# EAGLE design dwm-breakout (EAGLE 9.5.1)
AUTHOR: Neal Jackson; REV: A; TITLE: DWM1001C BREAKOUT
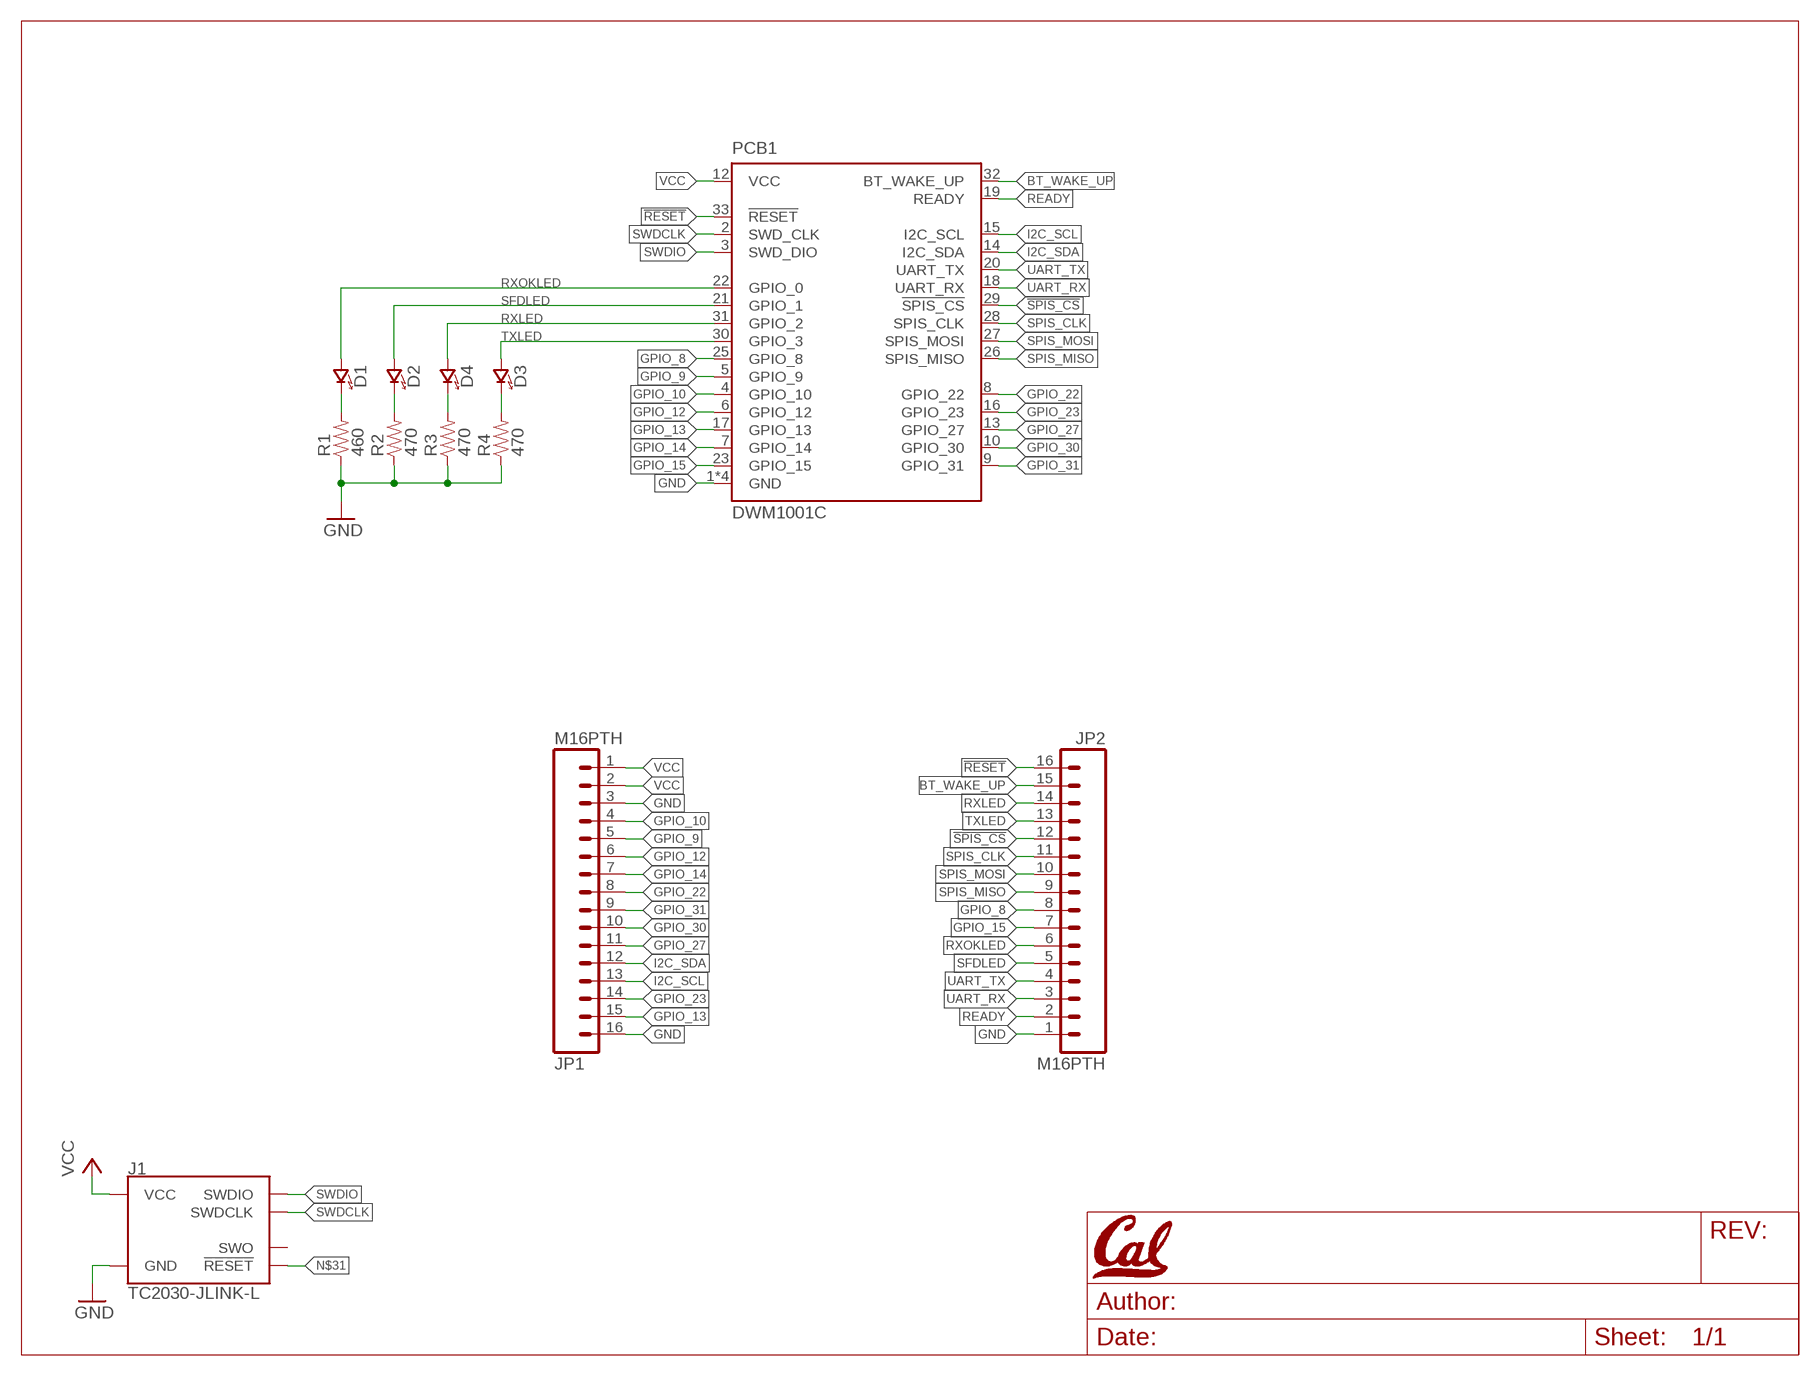
[diagram p0: schematic, sheet 1]
U$1 (LETTER_L_CAL): HEIGHT: 8.5in; WIDTH: 11in

## Parts
D1  LED0603  [LED-0603]
D2  LED0603  [LED-0603]
D3  LED0603  [LED-0603]
D4  LED0603  [LED-0603]
J1  TC2030-JLINK-L  [TC2030-IDC]
JP1  M16PTH  [1X16]
JP2  M16PTH  [1X16]
PCB1  DWM1001C  [DWM1001C]
R1  460  RESISTOR0402_RES  [0402_RES]
R2  470  RESISTOR0402_RES  [0402_RES]
R3  470  RESISTOR0402_RES  [0402_RES]
R4  470  RESISTOR0402_RES  [0402_RES]

## Nets
!RESET: JP2.16 PCB1.33(!RESET)
!SPIS_CS: JP2.12 PCB1.29(!SPIS_CS)
BT_WAKE_UP: JP2.15 PCB1.32(BT_WAKE_UP)
GND: J1.5(GND) JP1.3 JP1.16 JP2.1 PCB1.1(GND) PCB1.11(GND) PCB1.24(GND) PCB1.34(GND) R1.1 R2.1 R3.1 R4.1
GPIO_8: JP2.8 PCB1.25(GPIO_8)
GPIO_9: JP1.5 PCB1.5(GPIO_9)
GPIO_10: JP1.4 PCB1.4(GPIO_10)
GPIO_12: JP1.6 PCB1.6(GPIO_12)
GPIO_13: JP1.15 PCB1.17(GPIO_13)
GPIO_14: JP1.7 PCB1.7(GPIO_14)
GPIO_15: JP2.7 PCB1.23(GPIO_15)
GPIO_22: JP1.8 PCB1.8(GPIO_22)
GPIO_23: JP1.14 PCB1.16(GPIO_23)
GPIO_27: JP1.11 PCB1.13(GPIO_27)
GPIO_30: JP1.10 PCB1.10(GPIO_30)
GPIO_31: JP1.9 PCB1.9(GPIO_31)
I2C_SCL: JP1.13 PCB1.15(I2C_SCL)
I2C_SDA: JP1.12 PCB1.14(I2C_SDA)
N$1: D1.C(CATHODE) R1.2
N$6: D2.C(CATHODE) R2.2
N$7: D4.C(CATHODE) R3.2
N$8: D3.C(CATHODE) R4.2
N$31: J1.3(!RESET)
READY: JP2.2 PCB1.19(READY)
RXLED: D4.A(ANODE) JP2.14 PCB1.31(GPIO_2)
RXOKLED: D1.A(ANODE) JP2.6 PCB1.22(GPIO_0)
SFDLED: D2.A(ANODE) JP2.5 PCB1.21(GPIO_1)
SPIS_CLK: JP2.11 PCB1.28(SPIS_CLK)
SPIS_MISO: JP2.9 PCB1.26(SPIS_MISO)
SPIS_MOSI: JP2.10 PCB1.27(SPIS_MOSI)
SWDCLK: J1.4(SWDCLK) PCB1.2(SWD_CLK)
SWDIO: J1.2(SWDIO) PCB1.3(SWD_DIO)
TXLED: D3.A(ANODE) JP2.13 PCB1.30(GPIO_3)
UART_RX: JP2.3 PCB1.18(UART_RX)
UART_TX: JP2.4 PCB1.20(UART_TX)
VCC: J1.1(VCC) JP1.1 JP1.2 PCB1.12(VCC)
Unconnected: J1.6(SWO)

## Library data of the parts
D1 = leds:LED: LED; DIGIKEY: 160-1835-6-ND; MPN: LTST-C104KRKT
D2 = leds:LED: LED; DIGIKEY: 160-1837-6-ND; MPN: LTST-C194TBKT
D3 = leds:LED: LED; DIGIKEY: 160-1184-6-ND; MPN: LTST-C190YKT
D4 = leds:LED: LED; DIGIKEY: 160-1834-6-ND; MPN: LTST-C194KGKT
J1 = connector:TC2030-JLINK
JP1 JP2 = SparkFun-Connectors:M16: 1x16 .1" header
PCB1 = chips:DWM1001C: The DWM1001 module is based on Decawave's DW1000 Ultra Wideband (UWB) transceiver IC, which is an IEEE 802.15.4- 2011 UWB implementation. It integrates UWB and Bluetooth® antenna, all RF circuitry, Nordic Semiconductor nRF52832 and a motion sensor.; DIGIKEY: 1479-1004-1-ND; MPN: DWM1001C
R1-R4 = passives:RESISTOR: Resistor Basic schematic elements and footprints for 0201, 0402, 0603, 1206, and PTH resistors.; DIGIKEY: RHM470JCT-ND; MPN: MCR01MZPJ471

## Board
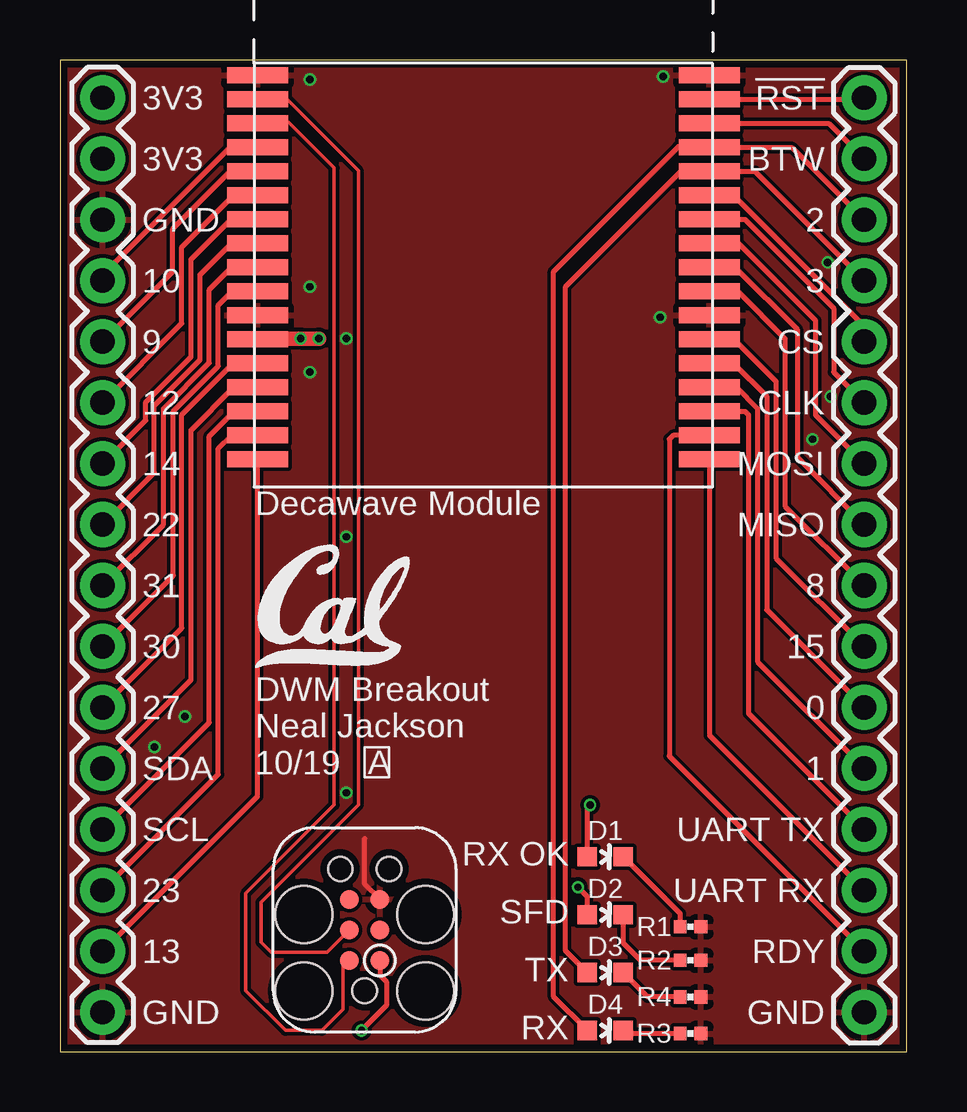
[diagram p1: board, top side]
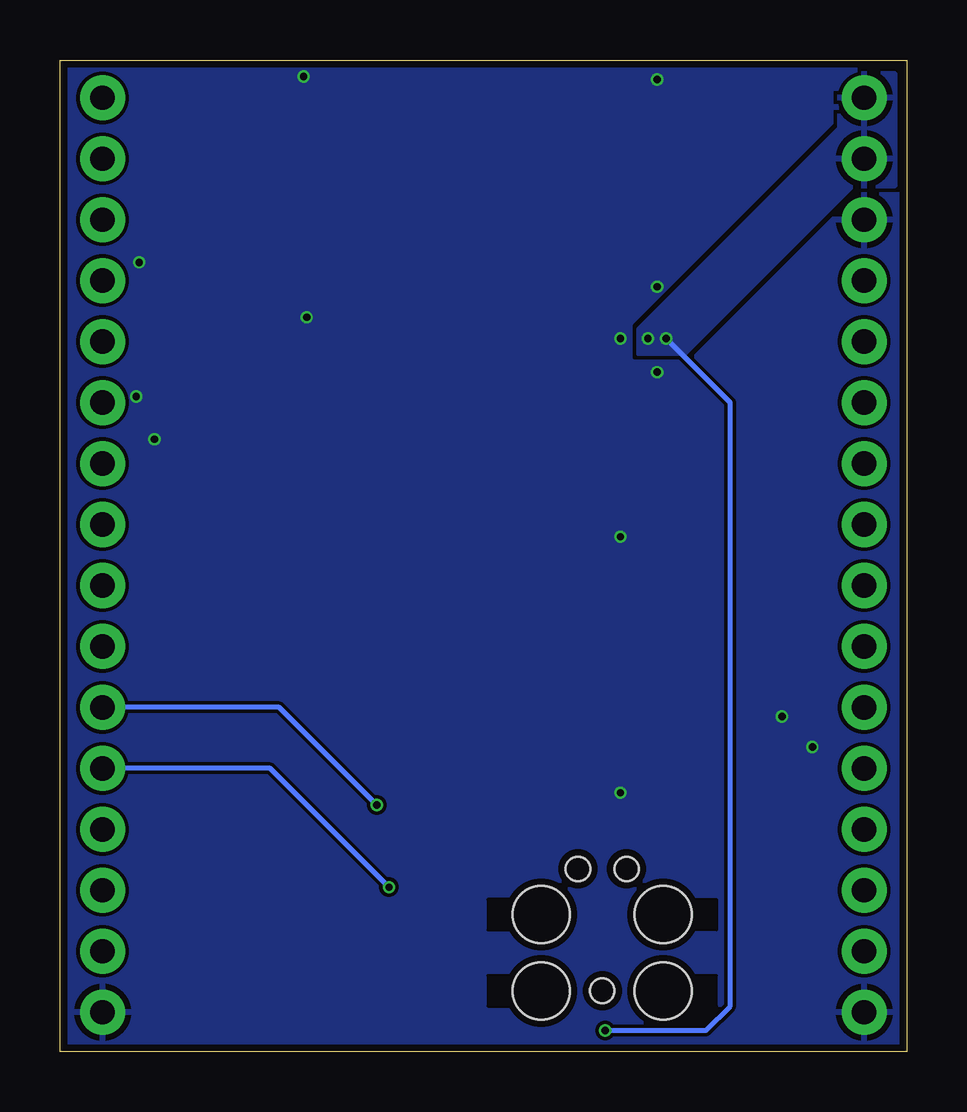
[diagram p2: board, bottom side, seen from below]

Size 35.31 x 41.33 mm. Coordinates in mm from the lower left corner, seen from the top.
Outline: 0,0 35.31,0 35.31,41.33 0,41.33 0,0
Copper layers (1*16): Top 0.0178mm / dielectric 59mil / Bottom 0.0178mm
Design rules "quickturn_co_kr_1oz": minimum track width 4mil, minimum drill 0.200659375mm, track to track 6mil, track to pad 6mil, pad to pad 6mil, via to via 6mil, smd to smd 6mil, copper to edge 12mil, drill to drill 12mil, minimum pad ring 8mil, minimum via ring 4mil, stop-mask expansion 3mil, vias tented up to drill 50mil, thermal gap 10mil

### Footprints (pad centres in the part's own frame; a part is rotated, then mirrored left to right if it is on the bottom)
LED-0603 = smd 0.8 x 0.8: A 0,-0.75; C 0,0.75
TC2030-IDC = smd 0.787 x 0.787: 1 -1.27,-0.635; 2 -1.27,0.635; 3 0,-0.635; 4 0,0.635; 5 1.27,-0.635; 6 1.27,0.635 | hole 2.375: -2.54,2.54; 0.635,2.54; 0.635,-2.54; -2.54,-2.54 | hole 1.016: -2.54,0; 2.54,1.016; 2.54,-1.016
1X16 = drill 1.016 pad 1.88: 1 0,0; 2 2.54,0; 3 5.08,0; 4 7.62,0; 5 10.16,0; 6 12.7,0; 7 15.24,0; 8 17.78,0; 9 20.32,0; 10 22.86,0; 11 25.4,0; 12 27.94,0; 13 30.48,0; 14 33.02,0; 15 35.56,0; 16 38.1,0
DWM1001C = smd 2.54 x 0.65: 1 -9.42,8; 2 -9.42,7; 3 -9.42,6; 4 -9.42,5; 5 -9.42,4; 6 -9.42,3; 7 -9.42,2; 8 -9.42,1; 9 -9.42,0; 10 -9.42,-1; 11 -9.42,-2; 12 -9.42,-3; 13 -9.42,-4; 14 -9.42,-5; 15 -9.42,-6; 16 -9.42,-7; 17 -9.42,-8; 18 9.42,-8; 19 9.42,-7; 20 9.42,-6; 21 9.42,-5; 22 9.42,-4; 23 9.42,-3; 24 9.42,-2; 25 9.42,-1; 26 9.42,0; 27 9.42,1; 28 9.42,2; 29 9.42,3; 30 9.42,4; 31 9.42,5; 32 9.42,6; 33 9.42,7; 34 9.42,8
0402_RES = smd 0.536 x 0.546: 1 -0.433,0; 2 0.433,0

### Placement (x,y rotation side)
D1  22.73,8.13 270 top
D2  22.73,5.71 270 top
D3  22.73,3.3 270 top
D4  22.73,0.89 270 top
J1  12.7,5.08 90 top
JP1  1.78,39.75 270 top
JP2  33.53,1.65 90 top
PCB1  17.65,32.69 0 top
R1  26.29,5.21 180 top
R2  26.29,3.81 180 top
R3  26.29,0.76 180 top
R4  26.29,2.29 180 top
U$2  [UCB_CAL_200MIL]  8.13,16 0 top

### Tracks (layer width: path | path; a pad name or v marks a point on that pad's centre or on a via)
!RESET
  Top 0.203: PCB1.33 33.47,39.69 JP2.16
!SPIS_CS
  Top 0.203: PCB1.29 28.06,35.69 33.53,30.23 JP2.12
BT_WAKE_UP
  Top 0.203: PCB1.32 32.05,38.69 JP2.15
GND  (via drill 0.3)
  Top 0.203: J1.5 12.7,6.99 12.7,8.89
  other vias: 32,32.89 32.13,27.3 31.37,25.53 3.94,12.7 5.21,13.97 11.94,10.79 11.94,21.46 11.94,29.72 10.41,28.32 10.41,31.88 10.41,40.51 25.02,30.61 25.15,40.64
  pour Top: 0,41.15 35.31,41.15 35.31,0 0,0
  pour Bottom (rank 2): 0,41.15 35.31,41.15 35.31,0 0,0
GPIO_8
  Top 0.203: PCB1.25 28.25,31.69 30.23,29.72 30.23,22.73 JP2.8
GPIO_9
  Top 0.203: JP1.5 4.7,32.51 4.7,34.29 7.11,36.7 8.22,36.7 PCB1.5
GPIO_10
  Top 0.203: PCB1.4 7.14,37.69 7.11,37.72 1.78,32.38 JP1.4
GPIO_12
  Top 0.203: PCB1.6 7.24,35.69 5.08,33.53 5.08,30.35 JP1.6
GPIO_13
  Top 0.203: JP1.15 8.23,10.65 PCB1.17
GPIO_14
  Top 0.203: PCB1.7 7.13,34.69 5.46,33.02 5.46,28.95 3.58,27.07 3.58,26.31 JP1.7
GPIO_15
  Top 0.203: PCB1.23 28.09,29.69 29.84,27.94 29.84,20.57 JP2.7
GPIO_22
  Top 0.203: JP1.8 3.94,24.13 3.94,26.92 5.84,28.83 5.84,32.38 7.15,33.69 PCB1.8
GPIO_23
  Top 0.203: PCB1.16 7.15,25.69 6.6,25.15 6.6,11.56 JP1.14
GPIO_27
  Top 0.203: JP1.11 5.08,17.65 5.08,26.54 7.24,28.7 8.22,28.7 PCB1.13
GPIO_30
  Top 0.203: PCB1.10 7.18,31.69 6.6,31.11 6.6,28.57 4.72,26.69 4.72,19.84 JP1.10
GPIO_31
  Top 0.203: JP1.9 4.32,21.97 4.32,26.8 6.22,28.7 6.22,31.75 7.16,32.69 PCB1.9
I2C_SCL
  Top 0.203: JP1.13 6.22,13.72 6.22,25.65 7.26,26.69 PCB1.15
I2C_SDA
  Top 0.203: JP1.12 5.46,15.49 5.46,25.91 7.24,27.69 PCB1.14
N$1
  Top 0.203: R1.2 25.86,5.75 D1.C
N$6
  Top 0.203: R2.2 24.2,3.81 23.48,4.53 D2.C
N$7
  Top 0.203: D4.C 23.61,0.76 R3.2
N$8
  Top 0.203: R4.2 24.5,2.29 D3.C
READY
  Top 0.203: PCB1.19 25.56,25.69 25.4,25.53 25.4,12.32 JP2.2
RXLED
  Top 0.203: JP2.14 30.51,37.69 PCB1.31 27.04,37.72 25.78,37.72 20.57,32.51 20.57,2.3 D4.A
RXOKLED  (via drill 0.3)
  Top 0.203: PCB1.22 28.08,28.69 29.46,27.3 29.46,18.41 JP2.6 | D1.A 21.98,10.17 v22.1,10.29
  Bottom 0.203: v22.1,10.29 26.16,14.35 JP2.6
SFDLED  (via drill 0.3)
  Top 0.203: PCB1.21 28.19,27.69 29.08,26.8 29.08,16.26 JP2.5 | D2.A 21.98,6.46 v21.59,6.86
  Bottom 0.203: v21.59,6.86 26.54,11.81 JP2.5
SPIS_CLK
  Top 0.203: 28.05,34.69 PCB1.28 28.56,34.69 32.26,30.99 32.26,28.32 JP2.11
SPIS_MISO
  Top 0.203: PCB1.26 28.14,32.69 30.73,30.1 30.73,24.77 JP2.9
SPIS_MOSI
  Top 0.203: PCB1.27 28.29,33.69 31.5,30.48 31.5,26.54 JP2.10
SWDCLK
  Top 0.152: J1.4 11.13,4.15 8.81,4.15 8.38,4.57 8.38,6.22 12.45,10.29 12.45,36.7 9.4,39.75 8.29,39.75 PCB1.2
SWDIO
  Top 0.152: J1.2 11.81,3.56 11.81,1.78 10.92,0.89 9.4,0.89 7.75,2.54 7.75,6.6 11.43,10.29 11.43,36.83 9.53,38.73 8.28,38.73 PCB1.3
TXLED
  Top 0.203: PCB1.30 27.3,36.69 | 27.3,36.69 28.97,36.69 JP2.13 | D3.A 21.08,4.2 21.08,31.88 25.91,36.7 27.29,36.7 27.3,36.69
UART_RX
  Top 0.203: PCB1.18 27.07,13.19 JP2.3
UART_TX
  Top 0.203: PCB1.20 28.55,26.69 28.7,26.54 28.7,14.1 JP2.4
VCC  (via drill 0.3)
  Top 0.203: J1.1 13.34,3.2 13.61,2.92 13.61,1.93 v12.57,0.89
  Top 0.61: v10.79,29.72 v10.03,29.72 8.26,29.72 PCB1.12
  Bottom 0.203: v12.57,0.89 8.38,0.89 7.37,1.91 7.37,27.05 v10.03,29.72
  pour Bottom: 0.51,40.77 0.51,36.07 2.29,36.07 9.27,29.08 11.18,29.08 11.18,30.1 2.79,38.48 2.79,40.26 2.29,40.77

### Text on the board
tNames: 3V3 | !RST | 3V3 | BTW | GND | 2 | 10 | 3 | 9 | CS | 12 | CLK | 14 | MOSI | 22 | Decawave Module | MISO | 31 | 8 | 30 | 15 | 27 | 0 | SDA | DWM Breakout / Neal Jackson / 10/19 | 1 | SCL | UART TX | RX OK | 23 | UART RX | SFD | 13 | RDY | TX | GND | GND | RX